# EAGLE design WattMeter_v4_I2C_Nov19_2018 (EAGLE 9.1.3)
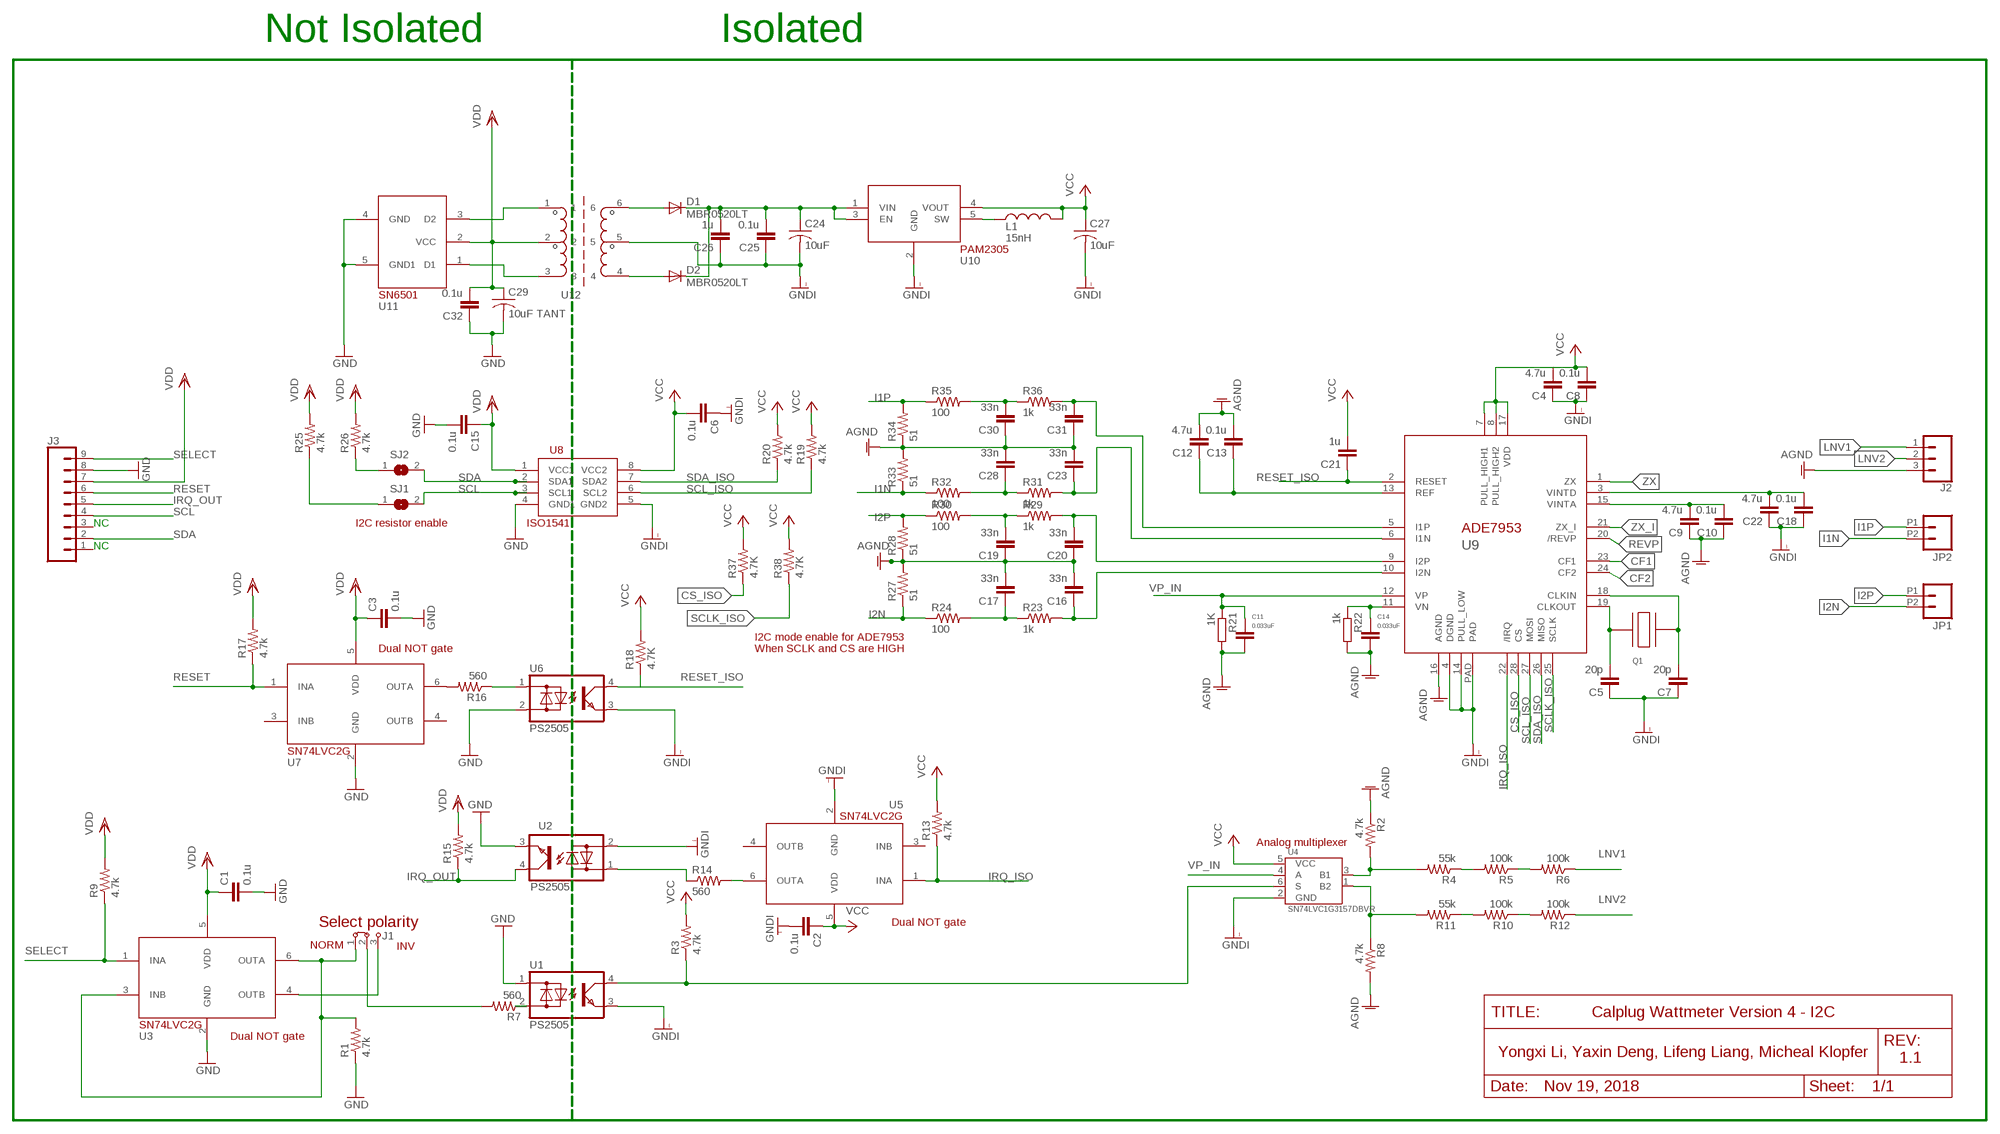
[diagram p0: schematic, sheet 1]

## Parts
C1  0.1u  0402-CAP  [0402-CAP]
C2  0.1u  0402-CAP  [0402-CAP]
C3  0.1u  0402-CAP  [0402-CAP]
C4  4.7u  0402-CAP  [0402-CAP]
C5  20p  0402-CAP  [0402-CAP]
C6  0.1u  0402-CAP  [0402-CAP]
C7  20p  0402-CAP  [0402-CAP]
C8  0.1u  0402-CAP  [0402-CAP]
C9  4.7u  0402-CAP  [0402-CAP]
C10  0.1u  0402-CAP  [0402-CAP]
C11  0.033uF  C-EUC0805K  [C0805K]
C12  4.7u  0402-CAP  [0402-CAP]
C13  0.1u  0402-CAP  [0402-CAP]
C14  0.033uF  C-EUC0805K  [C0805K]
C15  0.1u  0402-CAP  [0402-CAP]
C16  33n  0402-CAP  [0402-CAP]
C17  33n  0402-CAP  [0402-CAP]
C18  0.1u  0402-CAP  [0402-CAP]
C19  33n  0402-CAP  [0402-CAP]
C20  33n  0402-CAP  [0402-CAP]
C21  1u  0402-CAP  [0402-CAP]
C22  4.7u  0402-CAP  [0402-CAP]
C23  33n  0402-CAP  [0402-CAP]
C24  10uF  C-USC0603  [C0603]
C25  0.1u  0402-CAP  [0402-CAP]
C26  1u  0402-CAP  [0402-CAP]
C27  10uF  C-USC0603  [C0603]
C28  33n  0402-CAP  [0402-CAP]
C29  10uF TANT  C-USC0603  [C0603]
C30  33n  0402-CAP  [0402-CAP]
C31  33n  0402-CAP  [0402-CAP]
C32  0.1u  0402-CAP  [0402-CAP]
D1  MBR0520LT  [SOD123]
D2  MBR0520LT  [SOD123]
J1  JUMPER3  [1X03]
J2  CONN_03-SCREW-5MM  [SCREWTERMINAL-5MM-3]
J3  CONN_09  [1X09]
JP1  M022.54MM_SCREWTERM  [1X02_2.54_SCREWTERM]
JP2  M022.54MM_SCREWTERM  [1X02_2.54_SCREWTERM]
L1  15nH  IND0402  [0402-RES]
Q1  QUARTZ_3.58M_2PIN  [HC-49S]
R1  4.7k  0402-RES  [0402-RES]
R2  4.7k  RESISTOR0603-RES  [0603-RES]
R3  4.7k  0402-RES  [0402-RES]
R4  55k  RESISTOR0603-RES  [0603-RES]
R5  100k  RESISTOR0603-RES  [0603-RES]
R6  100k  RESISTOR0603-RES  [0603-RES]
R7  560  0402-RES  [0402-RES]
R8  4.7k  RESISTOR0603-RES  [0603-RES]
R9  4.7k  0402-RES  [0402-RES]
R10  100k  RESISTOR0603-RES  [0603-RES]
R11  55k  RESISTOR0603-RES  [0603-RES]
R12  100k  RESISTOR0603-RES  [0603-RES]
R13  4.7k  0402-RES  [0402-RES]
R14  560  0402-RES  [0402-RES]
R15  4.7k  0402-RES  [0402-RES]
R16  560  0402-RES  [0402-RES]
R17  4.7k  0402-RES  [0402-RES]
R18  4.7K  0402-RES  [0402-RES]
R19  4.7k  0402-RES  [0402-RES]
R20  4.7k  0402-RES  [0402-RES]
R21  1K  R-EU_  [C0805K@1]
R22  1k  R-EU_  [C0805K@1]
R23  1k  0402-RES  [0402-RES]
R24  100  0402-RES  [0402-RES]
R25  4.7k  0402-RES  [0402-RES]
R26  4.7k  0402-RES  [0402-RES]
R27  51  0402-RES  [0402-RES]
R28  51  0402-RES  [0402-RES]
R29  1k  0402-RES  [0402-RES]
R30  100  0402-RES  [0402-RES]
R31  1k  0402-RES  [0402-RES]
R32  100  0402-RES  [0402-RES]
R33  51  0402-RES  [0402-RES]
R34  51  0402-RES  [0402-RES]
R35  100  0402-RES  [0402-RES]
R36  1k  0402-RES  [0402-RES]
R37  4.7K  0402-RES  [0402-RES]
R38  4.7K  0402-RES  [0402-RES]
SJ1  SJ  [SJ]
SJ2  SJ  [SJ]
U1  PS2505  [PS2505]
U2  PS2505  [PS2505]
U3  SN74LVC  [DCKT]
U4  SN74LVC1G3157DBVR  [SOT-23-6]
U5  SN74LVC  [DCKT]
U6  PS2505  [PS2505]
U7  SN74LVC  [DCKT]
U8  ISO1541  [ISO1541]
U9  ADE7953  [28-WFQFN]
U10  PAM2305  [TSOT25]
U11  SN6501  [SOT-23-5]
U12  TRANSFO_3.3  [TRANSFO_3.3]

## Nets
AGND: C9.1 C10.1 C11.2 C12.2 C13.2 C14.2 C16.2 C17.2 C19.1 C20.1 C23.2 C28.2 C30.1 C31.1 J2.3 R2.1 R8.2 R21.2 R22.2 R27.2 R28.1 R33.2 R34.1 U9.16(AGND)
CF1: U9.23(CF1)
CF2: U9.24(CF2)
CS_ISO: R37.1 U9.28(CS)
GND: C1.2 C3.2 C15.2 C29.2 C32.1 J3.8 R1.1 U1.1(ANODE) U2.3(EMITTER) U3.2(GND) U6.2(CATHODE) U7.2(GND) U8.4(GND1) U11.4(GND) U11.5(GND1)
GNDI: C2.2 C4.1 C5.1 C6.1 C7.1 C8.1 C18.1 C22.1 C24.2 C25.1 C26.1 C27.2 U1.3(EMITTER) U2.2(CATHODE) U4.2(GND) U5.2(GND) U6.3(EMITTER) U8.5(GND2) U9.4(DGND) U9.14(PULL_LOW) U9.PAD U10.2(GND) U12.5
I1N: JP2.P2 R32.1 R33.1
I1P: JP2.P1 R34.2 R35.1
I2N: JP1.P2 R24.1 R27.1
I2P: JP1.P1 R28.2 R30.1
IRQ_ISO: R13.1 U5.1(INA) U9.22(/IRQ)
IRQ_OUT: J3.5 R15.1 U2.4(COLLERTOR)
LNV1: J2.1 R6.1
LNV2: J2.2 R12.1
N$1: C5.2 Q1.1 U9.19(CLKOUT)
N$2: C7.2 Q1.2 U9.18(CLKIN)
N$3 [ic]: C14.1 R22.1 U9.11(VN)
N$4: L1.1 U10.5(SW)
N$7: C12.1 C13.1 U9.13(REF)
N$8: C9.2 C10.2 U9.15(VINTA)
N$10: C23.1 R31.2 U9.6(I1N)
N$11: C31.2 R36.2 U9.5(I1P)
N$12: C18.2 C22.2 U9.3(VINTD)
N$13: R10.1 R12.2
N$17: J1.3 U3.4(OUTB)
N$18: D1.A U12.6
N$19: C24.1 C25.2 C26.2 D1.C D2.C U10.1(VIN) U10.3(EN)
N$20: D2.A U12.4
N$21: U11.3(D2) U12.1
N$22: R10.2 R11.1
N$23: U11.1(D1) U12.3
N$24: C30.2 R35.2 R36.1
N$25: R16.1 U6.1(ANODE)
N$26: R16.2 U7.6(OUTA)
N$27: C28.1 R31.1 R32.2
N$28: C16.1 R23.2 U9.10(I2N)
N$29: R26.1 SJ2.1
N$30: R14.2 U5.6(OUTA)
N$32: C20.2 R29.2 U9.9(I2P)
N$33: C19.2 R29.1 R30.2
N$34: C17.1 R23.1 R24.2
N$35: R5.1 R6.2
N$36: R4.1 R5.2
N$37: R8.1 R11.2 U4.1(B2)
N$38: R2.2 R4.2 U4.3(B1)
N$39: R14.1 U2.1(ANODE)
N$40: J1.1 R1.2 U3.3(INB) U3.6(OUTA)
N$42: J1.2 R7.2
N$43: R7.1 U1.2(CATHODE)
N$44: R25.1 SJ1.1
RESET: J3.6 R17.1 U7.1(INA)
RESET_ISO: C21.1 R18.1 U6.4(COLLERTOR) U9.2(RESET)
REVP: U9.20(/REVP)
SCL: J3.4 SJ1.2 U8.3(SCL1)
SCL_ISO: R19.1 U8.6(SCL2) U9.27(MOSI)
SCLK_ISO: R38.1 U9.25(SCLK)
SDA: J3.2 SJ2.2 U8.2(SDA1)
SDA_ISO: R20.1 U8.7(SDA2) U9.26(MISO)
SELECT: J3.9 R9.1 U3.1(INA)
SETPHASE: R3.1 U1.4(COLLERTOR) U4.6(S)
VCC: C2.1 C4.2 C6.2 C8.2 C21.2 C27.1 L1.2 R3.2 R13.2 R18.2 R19.2 R20.2 R37.2 R38.2 U4.5(VCC) U5.5(VDD) U8.8(VCC2) U9.7(PULL_HIGH1) U9.8(PULL_HIGH2) U9.17(VDD) U10.4(VOUT)
VDD: C1.1 C3.1 C15.1 C29.1 C32.2 J3.7 R9.2 R15.2 R17.2 R25.2 R26.2 U3.5(VDD) U7.5(VDD) U8.1(VCC1) U11.2(VCC) U12.2
VP_IN: C11.1 R21.1 U4.4(A) U9.12(VP)
ZX: U9.1(ZX)
ZX_I: U9.21(ZX_I)
Unconnected: J3.1 J3.3 U5.3(INB) U5.4(OUTB) U7.3(INB) U7.4(OUTB)

## Notes on the sheet
- Not Isolated | Isolated
- NC | I2C resistor enable
- NC
- I2C mode enable for ADE7953
- Dual NOT gate | When SCLK and CS are HIGH
- Analog multiplexer
- Select polarity | Dual NOT gate
- NORM | INV
- Calplug Wattmeter Version 4 - I2C
- Dual NOT gate
- Yongxi Li, Yaxin Deng, Lifeng Liang, Micheal Klopfer
- 1.1
- Nov 19, 2018

## Library data of the parts
C1-C10 C12 C13 C15-C23 C25 C26 C28 C30-C32 = Nizanlib:0402-CAP
C11 C14 = resistor:C-EU: CAPACITOR, European symbol
C24 C27 C29 = resistor:C-US: CAPACITOR, American symbol
D1 D2 = diode:MBR0520LT: SCHOTTKY BARRIER RECTIFIER Source: http://onsemi.com .. MBR0520LT1-D.pdf
J1 = Jumper:JUMPER3
J2 = SparkFun-Connectors:CONN_03: Multi connection point. Often used as Generic Header-pin footprint for 0.1 inch spaced/style header connections On any of the 0.1 inch spaced packages, you can populate with these: Break Away Headers - Straight <https://www.sparkfun.com/products/116> (PRT-00116) Break Away Male Headers - Right Angle <https://www.sparkfun.com/products/553> (PRT-00553) Female Headers <https://www.sparkfun.com/products/115> (PRT-00115) Break Away Headers - Machine Pin <https://www.sparkfun.com/products/117> (PRT-00117) Break Away Female Headers - Swiss Machine Pin <https://www.sparkfun.com/products/743> (PRT-00743) Stackable Header - 3 Pin (Female, 0.1") <https://www.sparkfun.com/products/13875> (PRT-13875) For SCREWTERMINALS and SPRING TERMINALS visit here: Screw Terimnals on SparkFun.com <https://www.sparkfun.com/search/results?term=Screw+Terminals> (5mm/3.5mm/2.54mm spacing) This device is also useful as a general connection point to wire up your design to another part of your project. Our various solder wires solder well into these plated through hole pads. Hook-Up Wire - Assortment (Stranded, 22 AWG) <https://www.sparkfun.com/products/11375> (PRT-11375) Hook-Up Wire - Assortment (Solid Core, 22 AWG) <https://www.sparkfun.com/products/11367> (PRT-11367) View the entire wire category on our website here <https://www.sparkfun.com/categories/141> Special notes: Molex polarized connector foot print use with SKU : PRT-08232 with associated crimp pins and housings.; PROD_ID: CONN-10134; SF_SKU: PRT-08433
J3 = SparkFun-Connectors:CONN_09: Multi connection point. Often used as Generic Header-pin footprint for 0.1 inch spaced/style header connections On any of the 0.1 inch spaced packages, you can populate with these: Break Away Headers - Straight <https://www.sparkfun.com/products/116> (PRT-00116) Break Away Male Headers - Right Angle <https://www.sparkfun.com/products/553> (PRT-00553) Female Headers <https://www.sparkfun.com/products/115> (PRT-00115) Break Away Headers - Machine Pin <https://www.sparkfun.com/products/117> (PRT-00117) Break Away Female Headers - Swiss Machine Pin <https://www.sparkfun.com/products/743> (PRT-00743) For SCREWTERMINALS and SPRING TERMINALS visit here: Screw Terimnals on SparkFun.com <https://www.sparkfun.com/search/results?term=Screw+Terminals> (5mm/3.5mm/2.54mm spacing) This device is also useful as a general connection point to wire up your design to another part of your project. Our various solder wires solder well into these plated through hole pads. Hook-Up Wire - Assortment (Stranded, 22 AWG) <https://www.sparkfun.com/products/11375> (PRT-11375) Hook-Up Wire - Assortment (Solid Core, 22 AWG) <https://www.sparkfun.com/products/11367> (PRT-11367) View the entire wire category on our website here <https://www.sparkfun.com/categories/141> Special notes: Molex polarized connector foot print use with SKU : PRT-08231 with associated crimp pins and housings. 1MM SMD Version SKU: PRT-10208 NOTES ON THE VARIANTS LOCK and LOCK_LONGPADS... This footprint was designed to help hold the alignment of a through-hole component (i.e. 6-pin header) while soldering it into place. You may notice that each hole has been shifted either up or down by 0.005 of an inch from it's more standard position (which is a perfectly straight line). This slight alteration caused the pins (the squares in the middle) to touch the edges of the holes. Because they are alternating, it causes a "brace" to hold the component in place. 0.005 has proven to be the perfect amount of "off-center" position when using our standard breakaway headers. Although looks a little odd when you look at the bare footprint, once you have a header in there, the alteration is very hard to notice. Also,if you push a header all the way into place, it is covered up entirely on the bottom side.
JP1 JP2 = SparkFun-Connectors:M02: Standard 2-pin 0.1" header. Use with - straight break away headers ( PRT-00116) - right angle break away headers (PRT-00553) - swiss pins (PRT-00743) - machine pins (PRT-00117) - female headers (PRT-00115) Molex polarized connector foot print use with: PRT-08233 with associated crimp pins and housings. 2.54_SCREWTERM for use with PRT-10571. 3.5mm Screw Terminal footprints for PRT-08084 5mm Screw Terminal footprints for use with PRT-08432
L1 = Nizanlib:IND0402
Q1 = CalPlug:QUARTZ_3.58M_2PIN; DIGIKEY: http://www.digikey.com/product-detail/en/txc-corporation/9C-3.579545MBBK-T/887-2450-1-ND/4475440
R1 R3 R7 R9 R13-R20 R23-R38 = Nizanlib:0402-RES
R2 R4-R6 R8 R10-R12 = SparkFun:RESISTOR: Resistor Basic schematic elements and footprints for 0603, 1206, and PTH 1/10th watt (small) resistors.
R21 R22 = resistor:R-EU_: RESISTOR, European symbol
SJ1 SJ2 = jumper:SJ: SMD solder JUMPER
U1 U2 U6 = wattmeter:PS2505
U3 U5 = Damien_divers:SN74LVC
U4 = TI:SN74LVC1G3157
U7 = Damien_divers:SN74LVC; SPICEPREFIX: X
U8 = wattmeter:ISO1541
U9 = CalPlug:ADE7953
U10 = Damien_regulator:PAM2305
U11 = CalPlug:SN6501
U12 = Damien_power:TRANSFO_3.3

## Net classes
0 default: clearance 0.205 mm
1 HIGHVOLTAGE: width 0.254 mm, drill 0.508 mm, clearance 2.413 mm to class 0, clearance 0.152 mm
2 ic: width 0.152 mm, drill 0.305 mm, clearance 0.205 mm to class 0, clearance 2.413 mm to class 1, clearance 0.205 mm

## Board
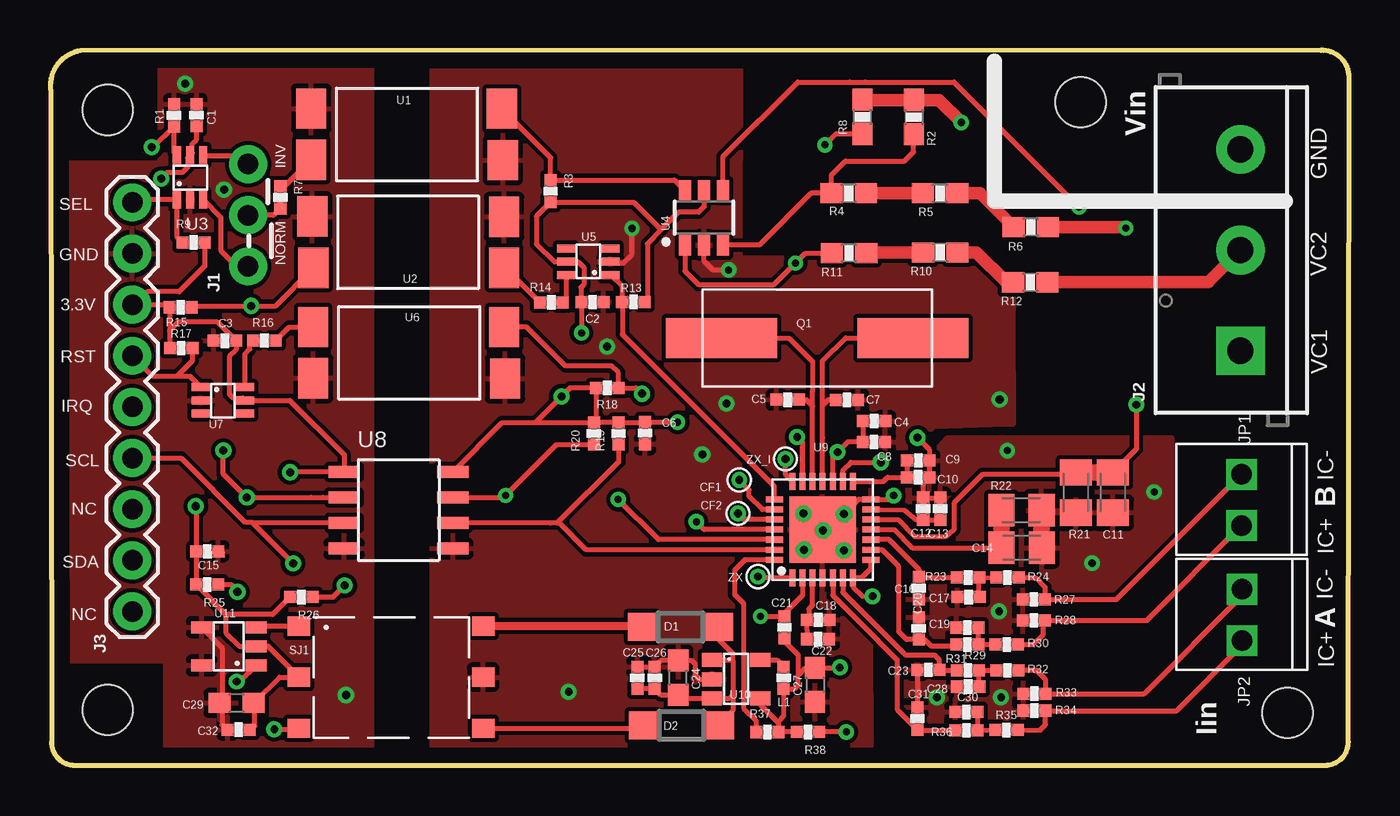
[diagram p1: board, top side]
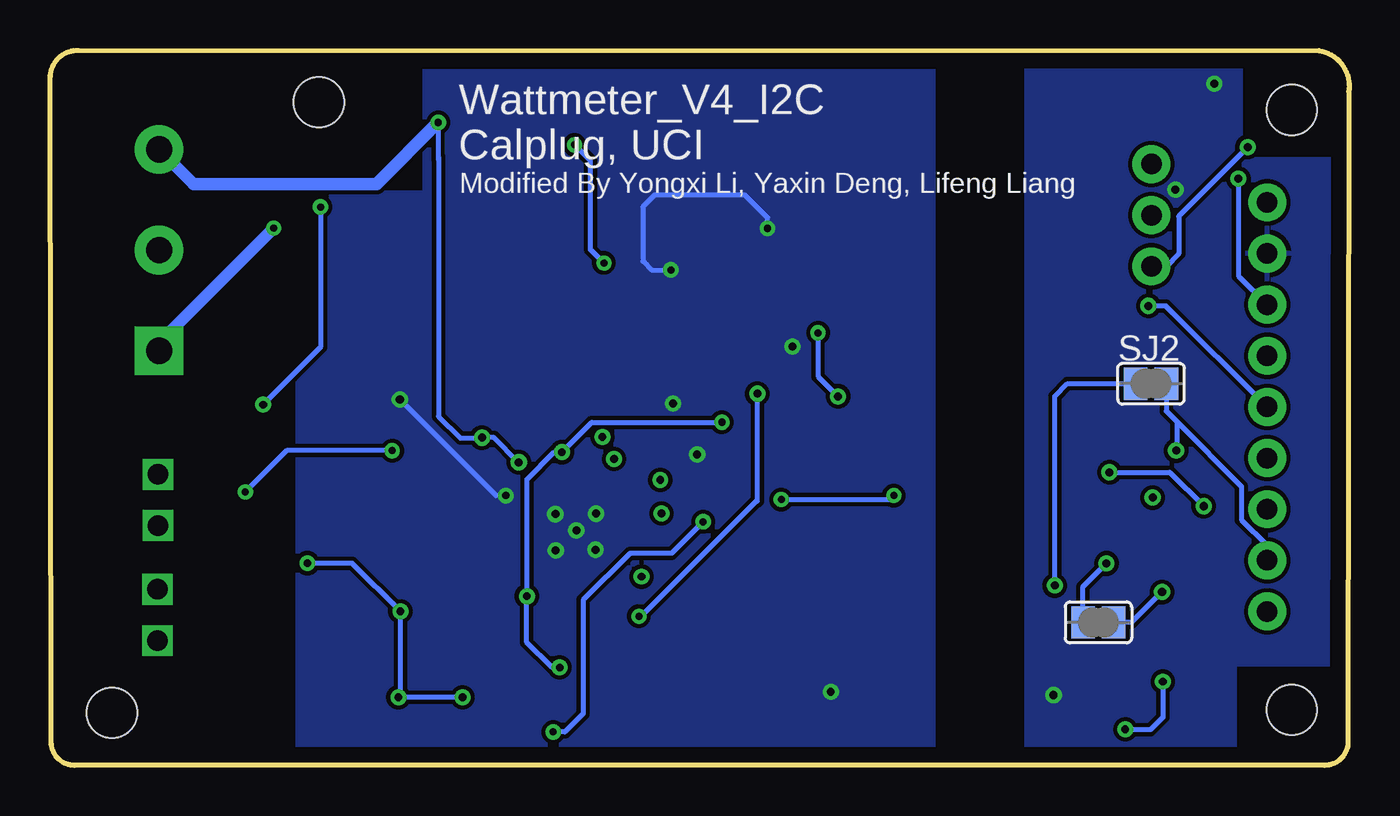
[diagram p2: board, bottom side, seen from below]

Size 64.5 x 35.51 mm. Coordinates in mm from the lower left corner, seen from the top.
Outline: 1.21,0 63.29,0 arc90 64.45,1.16 64.5,34.23 arc90 63.09,35.51 1.5,35.5 arc90 0.02,33.46 0.06,1.15 arc90 1.21,0
Copper layers (1*16): Top 0.035mm / dielectric 1.5mm / Bottom 0.035mm
Design rules "default *": minimum track width 10mil, minimum drill 15mil, track to track 8mil, track to pad 8mil, pad to pad 8mil, via to via 8mil, smd to smd 8mil, copper to edge 30mil, drill to drill 8mil, minimum pad ring 10mil, minimum via ring 8mil, stop-mask expansion 4mil, vias tented up to drill 0mil, thermal gap 10mil
Holes 2.5 mm at 2.85,32.56 2.85,2.76 51.16,32.94 61.43,2.61

### Footprints (pad centres in the part's own frame; a part is rotated, then mirrored left to right if it is on the bottom)
0402-CAP = smd 0.6 x 0.6: 1 -0.55,0; 2 0.55,0
C0805K = smd 1.3 x 1.6: 1 -1,0; 2 1,0
C0603 = smd 1.1 x 1: 1 -0.85,0; 2 0.85,0
SOD123 = smd 1.4 x 1.4: A 1.9,0; C -1.9,0
1X03 = drill 1.016 pad 1.88: 1 0,0; 2 2.54,0; 3 5.08,0
SCREWTERMINAL-5MM-3 = drill 1.3 pad 2.413 square: 1 0,0 | drill 1.3 pad 2.413: 2 5,0; 3 10,0
1X09 = drill 1.016 pad 1.88: 1 0,0; 2 2.54,0; 3 5.08,0; 4 7.62,0; 5 10.16,0; 6 12.7,0; 7 15.24,0; 8 17.78,0; 9 20.32,0
1X02_2.54_SCREWTERM = drill 1.016 square: P1 2.54,0; P2 0,0
0402-RES = smd 0.6 x 0.6: 1 -0.55,0; 2 0.55,0
HC-49S = smd 5.5 x 2: 1 -4.75,0; 2 4.75,0
0603-RES = smd 1.1 x 1: 1 -0.85,0; 2 0.85,0
C0805K@1 = smd 1.3 x 1.6: 1 -1,0; 2 1,0
SJ = smd 1.168 x 1.6: 1 -0.762,0; 2 0.762,0
PS2505 = smd 1.5 x 2: 1 0.381,3.575; 2 0.381,1.035; 3 9.906,1.016; 4 9.854,3.575
DCKT = smd 0.9 x 0.4: 1 0,1.3; 2 0,0.65; 3 0,0; 4 2.2,0; 5 2.2,0.65; 6 2.2,1.3
SOT-23-6 = smd 1.05 x 0.6: 1 -1.35,0.95; 2 -1.35,0; 3 -1.35,-0.95; 4 1.35,-0.95; 5 1.35,0; 6 1.35,0.95
ISO1541 = smd 0.6 x 1.55: 1 0,0; 2 1.27,0; 3 2.54,0; 4 3.81,0; 5 3.81,5.4; 6 2.54,5.4; 7 1.27,5.4; 8 0,5.4
28-WFQFN = smd 0.85 x 0.3: 1 -2.4,1.5; 2 -2.4,1; 3 -2.4,0.5; 4 -2.4,0; 5 -2.4,-0.5; 6 -2.4,-1; 7 -2.4,-1.5; 15 2.4,-1.5; 16 2.4,-1; 17 2.4,-0.5; 18 2.4,0; 19 2.4,0.5; 20 2.4,1; 21 2.4,1.5 | smd 0.3 x 0.85: 8 -1.5,-2.4; 9 -1,-2.4; 10 -0.5,-2.4; 11 0,-2.4; 12 0.5,-2.4; 13 1,-2.4; 14 1.5,-2.4; 22 1.5,2.4; 23 1,2.4; 24 0.5,2.4; 25 0,2.4; 26 -0.5,2.4; 27 -1,2.4; 28 -1.5,2.4 | smd 3.3 x 3.3: PAD 0,0
TSOT25 = smd 0.7 x 1: 1 0,0; 2 0.95,0; 3 1.9,0; 4 1.9,2.4; 5 0,2.4
SOT-23-5 = smd 0.6 x 1.05: 1 0,0; 2 0.95,0; 3 1.9,0; 4 1.9,2.7; 5 0,2.7
TRANSFO_3.3 = smd 1.12 x 0.96: 1 0,5.08; 2 0,2.54; 3 0,0; 4 9.14,0; 5 9.14,2.54; 6 9.14,5.08

### Placement (x,y rotation side)
C1  7.26,32.29 90 top
C2  26.92,23.01 0 top
C3  8.67,21.09 180 top
C4  40.91,17.1 180 top
C5  36.61,18.16 0 top
C6  29.53,16.5 90 top
C7  39.56,18.16 180 top
C8  40.9,16.06 180 top
C9  43.1,15.14 180 top
C10  43.1,14.31 180 top
C11  52.76,13.55 270 top
C12  43.34,12.74 90 top
C13  44.19,12.74 90 top
C14  48.23,10.81 0 top
C15  7.79,10.63 0.6 top
C16  43.12,8.8 270 top
C17  45.6,8.36 180 top
C18  38.13,7.23 180 top
C19  45.54,6.84 0 top
C20  43.12,6.8 270 top
C21  36.45,6.85 270 top
C22  38.12,6.27 180 top
C23  43.6,4.74 180 top
C24  31.18,4.36 90 top
C25  29.15,4.35 270 top
C26  30.01,4.35 270 top
C27  37.97,4 270 top
C28  45.57,3.91 180 top
C29  9.25,3.1 180 top
C30  45.49,2.65 0 top
C31  43.05,2.32 270 top
C32  9.35,1.77 0 top
D1  31.29,6.88 180 top
D2  31.34,1.99 180 top
J1  9.82,24.78 90 top
J2  59.09,20.59 90 top
J3  4.07,7.64 90 top
JP1  59.15,14.45 270 top
JP2  59.17,8.74 270 top
L1  36.41,4.35 270 top
Q1  38.08,21.22 0 top
R1  6.14,32.28 270 top
R2  42.87,32.2 270 top
R3  24.84,28.52 270 top
R4  39.65,28.41 180 top
R5  44.18,28.41 180 top
R6  48.69,26.73 180 top
R7  11.42,28.21 270 top
R8  40.33,32.21 90 top
R9  7.12,25.97 0 top
R10  44.19,25.47 180 top
R11  39.66,25.44 180 top
R12  48.66,23.99 180 top
R13  28.95,23.02 0 top
R14  24.87,22.99 0 top
R15  6.47,22.75 180 top
R16  10.63,21.1 180 top
R17  6.5,20.73 180 top
R18  27.65,18.75 180 top
R19  28.22,16.49 90 top
R20  26.99,16.48 90 top
R21  50.92,13.55 270 top
R22  48.22,12.67 0 top
R23  45.57,9.33 180 top
R24  47.53,9.33 180 top
R25  7.78,8.98 180 top
R26  12.47,8.36 180 top
R27  48.84,8.24 180 top
R28  48.84,7.2 0 top
R29  45.54,6 180 top
R30  47.49,6 180 top
R31  45.56,4.72 180 top
R32  47.52,4.72 180 top
R33  48.86,3.56 180 top
R34  48.86,2.72 0 top
R35  47.48,1.76 180 top
R36  45.49,1.74 180 top
R37  35.61,1.65 0 top
R38  37.63,1.66 180 top
SJ1  12.45,7.1 180 bottom
SJ2  9.84,18.96 0 bottom
U1  12.56,29.04 0 top
U2  22.92,28.28 180 top
U3  7.59,28.09 90 top
U4  32.46,27.2 90 top
U5  27.81,25.66 180 top
U6  12.67,18.19 0 top
U7  7.47,17.48 0 top
U8  14.59,14.58 270 top
U9  38.35,11.71 90 top
U10  32.85,5.23 270 top
U11  10.21,4.96 90 top
U12  12.35,1.84 0 top

### Tracks (layer width: path | path; a pad name or v marks a point on that pad's centre or on a via)
AGND  (via drill 0.35, 0.38, 0.4)
  Top 0.254: 50.8,12.67 R21.2 | C23.2 C31.1 | C13.2 C12.2 43.34,14 C10.1 C9.1 | 39.33,14.09 U9.16 39.37,14.13 39.37,14.67 39.75,15.05 v41.24,15.05 | 43.62,15.14 C9.1 | v43.06,16.27 43.65,15.68 C9.1
  Top 0.61: v45.23,31.93 44.11,33.05 R2.1 R8.2
  Top 0.813: R22.2 C14.2
  Bottom 0.254: v51.73,10.04 49.5,10.04 v47.11,7.65 47.11,3.48 v47.21,3.38 v44.02,3.38 | v41.24,15.05 42.46,16.27 v43.06,16.27 43.08,16.25 44.14,16.25 45.22,17.34 45.22,30.09 | 45.22,30.22 45.22,30.09 | v45.23,31.93 45.23,30.1 45.22,30.09 | v47.52,15.63 52.76,15.63 v54.81,13.57
  Bottom 0.61: v45.23,31.93 48.28,28.88 57.38,28.88 J2.3
  pour Top: 41.31,0.94 41.32,12.63 44.56,16.29 55.65,16.32 55.68,16.29 55.68,1.01 55.59,0.92
CF1  (via drill 0.38)
  Top 0.254: U9.23 35.36,12.71 34.7,13.36 34.7,13.68 v34.21,14.17
CF2  (via drill 0.38)
  Top 0.254: U9.24 34.46,12.21 v34.15,12.51
CS_ISO
  Top 0.254: R37.1 35.06,2.21 34.42,2.84 34.42,8.04 33.97,8.48 33.97,9.69 34.49,10.21 U9.28
GND  (via drill 0.4)
  Top 0.254: 8.46,2.72 C29.2 | U11.4 8.52,5.85 8.52,2 | U6.2 12.61,18.79
  other vias: 6.7,33.85 14.68,3.49 8.62,28.59
  pour Top: 5.74,0.28 5.74,5.13 5.72,5.15 0.41,5.15 0.41,29.91 0.39,29.93 5.43,29.93 5.45,29.95 5.45,35.11 5.41,35.16 15.91,35.16 15.95,35.11 15.95,0.3 15.93,0.28 15.91,0.26 5.7,0.26
  pour Bottom: 5.68,0.59 5.68,4.99 5.74,5.05 0.47,5.05 0.47,30.05 0.5,30.08 5.37,30.08 5.39,30.05 5.39,35.13 5.37,35.16 15.97,35.16 16.04,35.09 16.04,0.53 16.08,0.49 5.67,0.49 5.65,0.46
GNDI  (via drill 0.35, 0.38, 0.4)
  Top 0.254: C22.1 38.68,6.16 | 29.42,15.84 C6.1 | C25.1 C26.1 30.32,5.21 C24.2 31.85,5.21 32.01,5.04 32.01,4.48 32.22,4.28 U10.2 | U5.2 27.88,24.94 | v41.88,13.4 41.69,13.21 U9.14 40.15,13.21 v39.42,12.48 39.12,12.48 | 27.88,24.94 | 27.88,24.94 28.45,24.94 28.88,25.37 v28.88,26.67 | v33.68,24.61 32.9,24.61 32.46,25.05 U4.2
  Bottom 0.254: v41.88,13.4 42.37,13.4 v47.14,18.17 | v28.88,26.67 28.88,27.21 30,28.33 34.48,28.33 35.07,27.75 35.07,25.04 34.64,24.61 v33.68,24.61
  other vias: 25.74,3.65 37.4,12.5 38.37,11.66 37.42,10.71 39.4,10.67 33.57,17.98 32.38,15.43 27.65,20.8
  pour Top: 18.95,0.61 18.95,34.87 18.93,34.89 34.28,34.84 34.23,25.22 41.88,25.23 47.91,25.14 47.8,22.25 47.81,16.93 47.52,16.92 43.86,16.8 40.71,12.78 40.74,0.55 18.96,0.47 18.94,0.48
  pour Bottom: 20.67,34.77 20.67,0.71 52.18,0.71 52.18,28.45 45.88,28.45 45.88,34.63 20.68,34.63 20.68,34.6
I1N
  Top 0.254: R32.1 48.96,4.72 49.41,4.27 R33.1 54.32,3.56 59.17,8.42 JP2.P2
I1P
  Top 0.254: R34.2 49.41,2.02 49.14,1.75 R35.1 | R34.2 49.45,2.76 | R34.2 55.94,2.72 59.17,5.96 JP2.P1
I2N
  Top 0.254: JP1.P2 52.94,8.24 R27.1 49.39,8.85 48.91,9.33 R24.1
I2P
  Top 0.254: R30.1 48.8,6 49.3,6.5 49.3,7.11 R28.2 54.44,7.2 JP1.P1
IRQ_ISO
  Top 0.254: U5.1 28.4,23.77 R13.1 28.4,21.41 35.95,13.86 U9.22
IRQ_OUT  (via drill 0.4)
  Top 0.254: R15.1 7.08,22.81 9.96,22.81 v9.97,22.82 11.18,22.82 U2.4
  Bottom 0.254: J3.5 9.09,22.82 v9.97,22.82
LNV1  (via drill 0.35)
  Top 0.61: R6.1 53.36,26.73 v53.41,26.68
  Bottom 0.61: v53.41,26.68 59.09,21 J2.1
LNV2
  Top 0.61: 58.94,25.44 J2.2 57.49,23.99 R12.1
N$1
  Top 0.254: U9.19 37.85,17.84 | 37.85,17.84 37.85,18.58 37.85,18.59 37.85,20.07 36.69,21.22 Q1.1 | C5.2 37.53,18.16 37.85,17.84
N$2
  Top 0.254: U9.18 38.35,16.26 | 38.35,16.26 38.35,17.88 | 38.35,17.88 38.35,20.1 39.48,21.23 42.82,21.23 Q1.2 | 38.36,16.27 38.35,16.26 | C7.2 38.62,18.16 38.35,17.88
N$3
  Top 0.254: U9.11 41.89,11.71 42.79,10.81 C14.1 | 47.03,12.48 R22.1
  Top 0.813: R22.1 C14.1
N$4
  Top 0.254: U10.5 36.08,5.23 L1.1
N$7
  Top 0.254: U9.13 42.4,12.68 43.01,12.19 C12.1 C13.1
N$8
  Top 0.254: C9.2 C10.2 41.58,14.31 41.38,14.11 40.85,14.11 U9.15
N$10
  Top 0.254: R31.2 44.17,4.72 C23.1 44.15,5.24 43.92,5.47 42.47,5.47 42.37,5.57 40.6,7.35 39.35,8.6 U9.6 | U9.6 39.37,9.29 | U9.6
N$11
  Top 0.254: R36.2 43.09,1.74 C31.2 42.04,2.79 42.04,5.25 40.14,7.16 38.85,8.45 U9.5
N$12
  Top 0.254: U9.3 37.85,7.95 37.66,7.76 37.66,7.31 C18.2 37.56,7.21 C22.2
N$13
  Top 0.61: R10.1 45.99,25.47 47.47,23.99 R12.2
N$17
  Top 0.254: U3.4 9.39,30.29 J1.3
N$18
  Top 0.406: U12.6 29.39,6.92 D1.A
N$19
  Top 0.254: C24.1 30.3,3.51 C26.2 C25.2 | 31.36,3.33 U10.3 33.75,3.33 33.89,3.47 | D2.C 33.21,1.77 arc-90 33.2,1.78 | 33.19,5.24 arc90 U10.1 33.88,5.23 33.89,5.22 | D2.C 33.26,2.01 | D2.C 33.2,2.03 33.89,2.72 33.89,3.47 | D1.C 33.19,6.24 33.89,5.54 33.89,5.22 | 33.89,5.22 33.89,3.47
  Top 0.406: C24.1 31.36,3.33
N$20
  Top 0.254: U12.4 29.29,1.84 D2.A
N$21
  Top 0.254: U11.3 10.27,6.92 U12.1
N$22
  Top 0.61: R11.1 40.54,25.47 R10.2
N$23  (via drill 0.38)
  Top 0.254: v11.12,1.79 12.3,1.79 U12.3 | v9.25,4.16 9.41,4.16 U11.1
  Bottom 0.254: v9.25,4.16 9.25,2.38 9.86,1.77 11.1,1.77 v11.12,1.79
N$24
  Top 0.254: R35.2 R36.1 C30.2
N$25
  Top 0.254: R16.1 11.85,21.77 U6.1
N$26
  Top 0.254: U7.6 9.67,20.43 9.91,20.67 9.91,20.93 R16.2
N$27
  Top 0.254: C28.1 R31.1 R32.2
N$28
  Top 0.254: C16.1 43.14,9.33 R23.2 | U9.10 41.64,11.21 43.12,9.73 C16.1 | 43.12,9.51 C16.1
N$29  (via drill 0.4)
  Top 0.254: R26.1 14.04,8.36 v14.62,8.93
  Bottom 0.254: v14.62,8.93 14.62,14.35 14.62,18.33 13.99,18.96 SJ2.1
N$30
  Top 0.254: U5.6 25.61,23.18 R14.2
N$32
  Top 0.254: 43.12,6.28 C20.2 | R29.2 44.92,5.93 43.73,5.93 43.41,6.25 C20.2 | C20.2 42.52,6.25 42.13,6.64 42.13,9.87 41.31,10.69 40.81,10.69 40.78,10.71 40.77,10.7 40.76,10.7 U9.9
N$33
  Top 0.254: C19.2 R29.1 R30.2
N$34
  Top 0.254: C17.1 46.12,8.49 R23.1 R24.2
N$35
  Top 0.61: 45.14,28.3 R5.1 46.16,28.41 R6.2
N$36
  Top 0.61: R4.1 R5.2
N$37  (via drill 0.35)
  Top 0.254: R8.1 39,31.36 v38.46,30.82 | 36.76,24.7 36.96,24.9 | 36.96,24.9 v37.01,24.95 37.5,25.44 R11.2 | U4.1 31.51,24.56 32.19,23.88 35.94,23.88 36.96,24.9
  Bottom 0.254: v37.01,24.95 37.68,25.62 37.68,30.03 v38.46,30.82
N$38
  Top 0.254: 42.85,31.33 R2.2 42.86,31.34 42.86,30.46 42.41,30.02 39.49,30.02 38.8,29.32 R4.2 37.78,28.41 35.22,25.85 U4.3
N$39
  Top 0.254: U2.1 22.61,24.71 R14.1
N$40  (via drill 0.4)
  Top 0.254: U3.6 6.14,30.44 R1.2 5.12,30.71 v5.04,30.71 | U3.3 8.47,27.21 8.47,25.56 9.24,24.78 J1.1
  Bottom 0.254: v5.04,30.71 8.47,27.28 8.47,25.41 9.12,24.76 9.8,24.76 J1.1
N$42
  Top 0.254: R7.2 11.08,27.32 J1.2
N$43
  Top 0.254: 12.95,29.42 U1.2 11.64,28.76 R7.1
N$44  (via drill 0.4)
  Top 0.254: R25.1 8.99,8.98 v9.29,8.61
  Bottom 0.254: v9.29,8.61 10.81,7.1 SJ1.1
RESET
  Top 0.254: J3.6 5.08,19.33 6.29,19.33 | 6.29,19.33 6.92,19.33 U7.1 | R17.1 7.05,20.09 6.29,19.33
RESET_ISO  (via drill 0.35, 0.4)
  Top 0.254: 28.17,18.75 R18.1 | R18.1 | R18.1 29.09,18.75 v29.38,18.46 | R18.1 28.2,19.5 27.86,19.84 25.58,19.84 23.66,21.77 U6.4 | U9.2 37.35,8.45 36.45,7.55 C21.1 v35.27,7.4
  Bottom 0.254: 29.38,13.13 29.38,13.19 | 29.38,13.19 v29.38,18.46 | 29.38,13.19 35.17,7.4 v35.27,7.4
REVP  (via drill 0.38)
  Top 0.254: 37.35,15.84 U9.20 37.35,16.04 v37.08,16.31
SCL  (via drill 0.4)
  Top 0.254: J3.4 6.49,15.26 9.68,12.07 10.01,12.07 | U8.3 14.56,12.07 10.01,12.07 | v12.06,10.03 10.01,12.07
  Bottom 0.254: SJ1.2 13.21,8.87 v12.06,10.03
SCL_ISO
  Top 0.254: 35.93,10.69 U9.27 26.6,10.71 25.28,12.04 25.17,12.04 | R19.1 28.23,15.93 28.23,15.09 25.17,12.04 | 25.17,12.04 24.82,12.04 U8.6
SCLK_ISO  (via drill 0.35)
  Top 0.254: U9.25 32.47,11.71 v32.08,12.1 | v39.52,1.66 R38.1 | R38.1
  Bottom 0.254: v32.08,12.1 33.65,10.53 35.71,10.53 38.03,8.21 38.03,2.57 38.94,1.66 v39.52,1.66
SDA  (via drill 0.4)
  Top 0.254: U8.2 13.53,13.31 12.95,13.31 v9.76,13.3 8.59,14.47 v8.59,15.63
  Bottom 0.254: 4.32,10.18 4.09,10.18 | 4.09,10.18 J3.2 | 4.09,10.18 4.09,10.94 5.34,12.19 5.34,13.86 8.56,17.08 | SJ2.2 9.08,17.59 8.56,17.08 | 8.56,17.08 8.56,15.67 v8.59,15.63
SDA_ISO  (via drill 0.35)
  Top 0.254: U8.7 22.51,13.31 v22.61,13.4 25.13,15.93 R20.1 | U9.26 30.2,11.21 v28.2,13.21
  Bottom 0.254: v28.2,13.21 22.8,13.21 v22.61,13.4
SELECT
  Top 0.254: J3.9 4.21,28.09 U3.1 6.29,26.26 R9.1
SETPHASE
  Top 0.254: 24.77,29.14 R3.1 | R3.1 30.99,29.07 U4.6 | R3.1 24.84,30.19 U1.4
VCC  (via drill 0.35, 0.38, 0.4)
  Top 0.254: 39.85,9.04 U9.7 | U9.7 40.27,9.31 40.73,9.75 40.73,10.17 U9.8 40.73,10.23 | U9.7 39.88,8.85 40.32,8.41 v40.83,8.4 | 29.47,17.11 C6.2 | L1.2 36.41,3.83 | v39.2,4.86 38.93,4.85 C27.1 37.5,4.85 37.13,4.48 | R19.2 28.23,17.05 28.2,17.07 | R19.2 28.21,17.03 R20.2 | U8.8 22.44,17.03 24.08,17.03 | 24.08,17.03 R20.2 | R37.2 36.18,1.63 | 36.18,1.63 36.26,1.63 36.15,1.75 36.15,2.11 | 29.4,22.96 R13.2 29.64,23.02 29.64,25.91 30.33,26.61 | R20.2 27.1,17.14 R18.2 25.8,18.75 v25.38,18.32 24.08,17.03 | 26.2,22.84 C2.1 | C4.2 C8.2 39.6,16.06 v39.1,15.55 38.85,15.31 U9.17 | R19.2 29.52,17.04 C6.2 | v31.14,17.04 C6.2 | 30.33,26.61 31.2,27.47 32.19,27.47 32.46,27.74 U4.5 | 30.33,26.61 28.97,27.97 R3.2 24.14,27.27 24.14,25.9 25.03,25.01 U5.5 26.2,25.01 26.5,24.71 26.5,23.89 26.35,23.74 26.35,23.03 C2.1 | v26.38,21.48 v26.37,21.48 C2.1 | L1.2 36.41,2.46 36.15,2.19 36.15,2.11 | U10.4 35.25,3.01 36.15,2.11 | L1.2 36.95,3.8 37.13,3.98 37.13,4.48 | C21.2 36.47,6.13 37.13,5.48 37.13,4.48 | R38.2 36.2,1.66 36.18,1.63
  Bottom 0.254: v31.14,17.04 37.61,17.04 v39.1,15.55 39.48,15.55 40.83,14.2 v40.83,8.4 40.83,8.1 40.84,8.09 40.84,6.12 39.58,4.86 v39.2,4.86 | v26.38,21.48 26.38,19.32 v25.38,18.32
VDD  (via drill 0.4)
  Top 0.254: C29.1 10.16,3.16 | 10.16,3.16 11.38,4.38 U12.2 10.82,5.91 U11.2 9.41,5.9 8.72,6.59 8.72,7.49 | C32.2 10.16,1.95 10.16,3.16 | U8.1 15.24,14.58 | U3.5 7.05,30.41 7.05,30.88 7.26,31.09 C1.1 | 6.86,30.22 U3.5 | R26.2 11.05,7.49 8.72,7.49 | R9.2 7.67,24.83 7.69,24.81 6.4,23.53 4.83,23.53 4.18,22.88 J3.7 5.79,22.88 R15.2 5.92,21.58 | 8.72,7.49 R25.2 7.24,8.99 C15.1 7.24,12.85 v7.22,12.87 | U8.1 14.59,15.43 11.89,18.13 U7.5 9.55,18.25 9.08,18.25 8.89,18.44 8.89,20.3 9.22,20.63 C3.1 8.28,22.04 6.37,22.04 5.92,21.58 | 5.92,21.58 5.92,20.77 R17.2 | U8.1 11.93,14.58 v11.91,14.55 | U3.5 6.82,30.18 6.82,29.71 6.55,29.44 5.8,29.44 v5.5,29.14
  Bottom 0.254: v11.91,14.55 8.9,14.55 v7.22,12.87 | v5.5,29.14 5.5,24.31 J3.7
VP_IN  (via drill 0.35, 0.38)
  Top 0.254: U9.12 42.08,12.21 42.9,11.37 44.48,11.37 44.87,11.73 44.87,13.02 46.29,14.44 50.81,14.44 R21.1 | v51.08,27.74 44.88,33.94 40.47,33.94 39.69,33.94 37.12,33.94 33.41,30.24 U4.4 | v53.93,17.92 53.93,15.72 C11.1
  Top 0.813: R21.1 C11.1
  Bottom 0.254: v51.08,27.74 51.08,20.77 v53.93,17.92
ZX  (via drill 0.38)
  Top 0.254: U9.1 35.2,9.31 v35.14,9.37
ZX_I  (via drill 0.38)
  Top 0.254: U9.21 36.51,14.45 v36.51,15.22

### Text on the board
tPlace: GND | INV | NORM | ZX_I | CF1 | CF2 | ZX
tNames: Vin | SEL | GND | VC2 | 3.3V | RST | VC1 | IRQ | JP1 | SCL | IC- | NC | B | IC+ | SDA | IC- | NC | A | IC+ | JP2 | Iin
bNames: Wattmeter_V4_I2C | Calplug, UCI | Modified By Yongxi Li, Yaxin Deng, Lifeng Liang